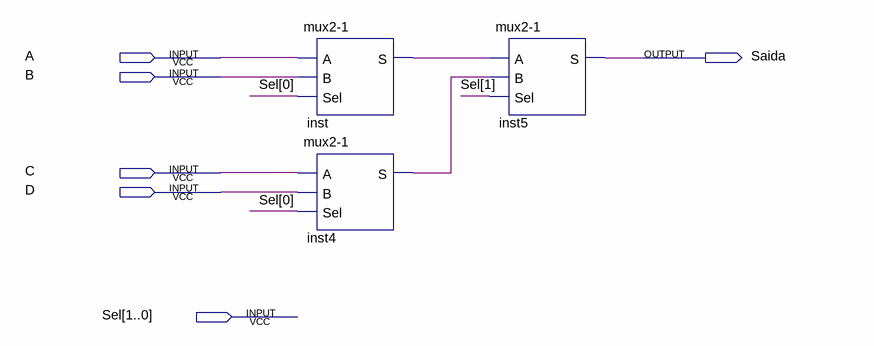
[diagram p0: schematic sheet]
// Quartus schematic mux4-1.bdf as structural Verilog: 3 symbols, 6 pins
module \mux4-1  (
  input  A,
  input  B,
  input  C,
  input  D,
  input  [1:0] Sel,
  output Saida
);

  wire inst4_s, inst_s;

  \mux2-1  inst (.A(A), .B(B), .Sel(Sel[0]), .S(inst_s));
  \mux2-1  inst4 (.A(C), .B(D), .Sel(Sel[0]), .S(inst4_s));
  \mux2-1  inst5 (.A(inst_s), .B(inst4_s), .Sel(Sel[1]), .S(Saida));
endmodule
